# Altium schematic sheet Sheet2.SchDoc
size A3
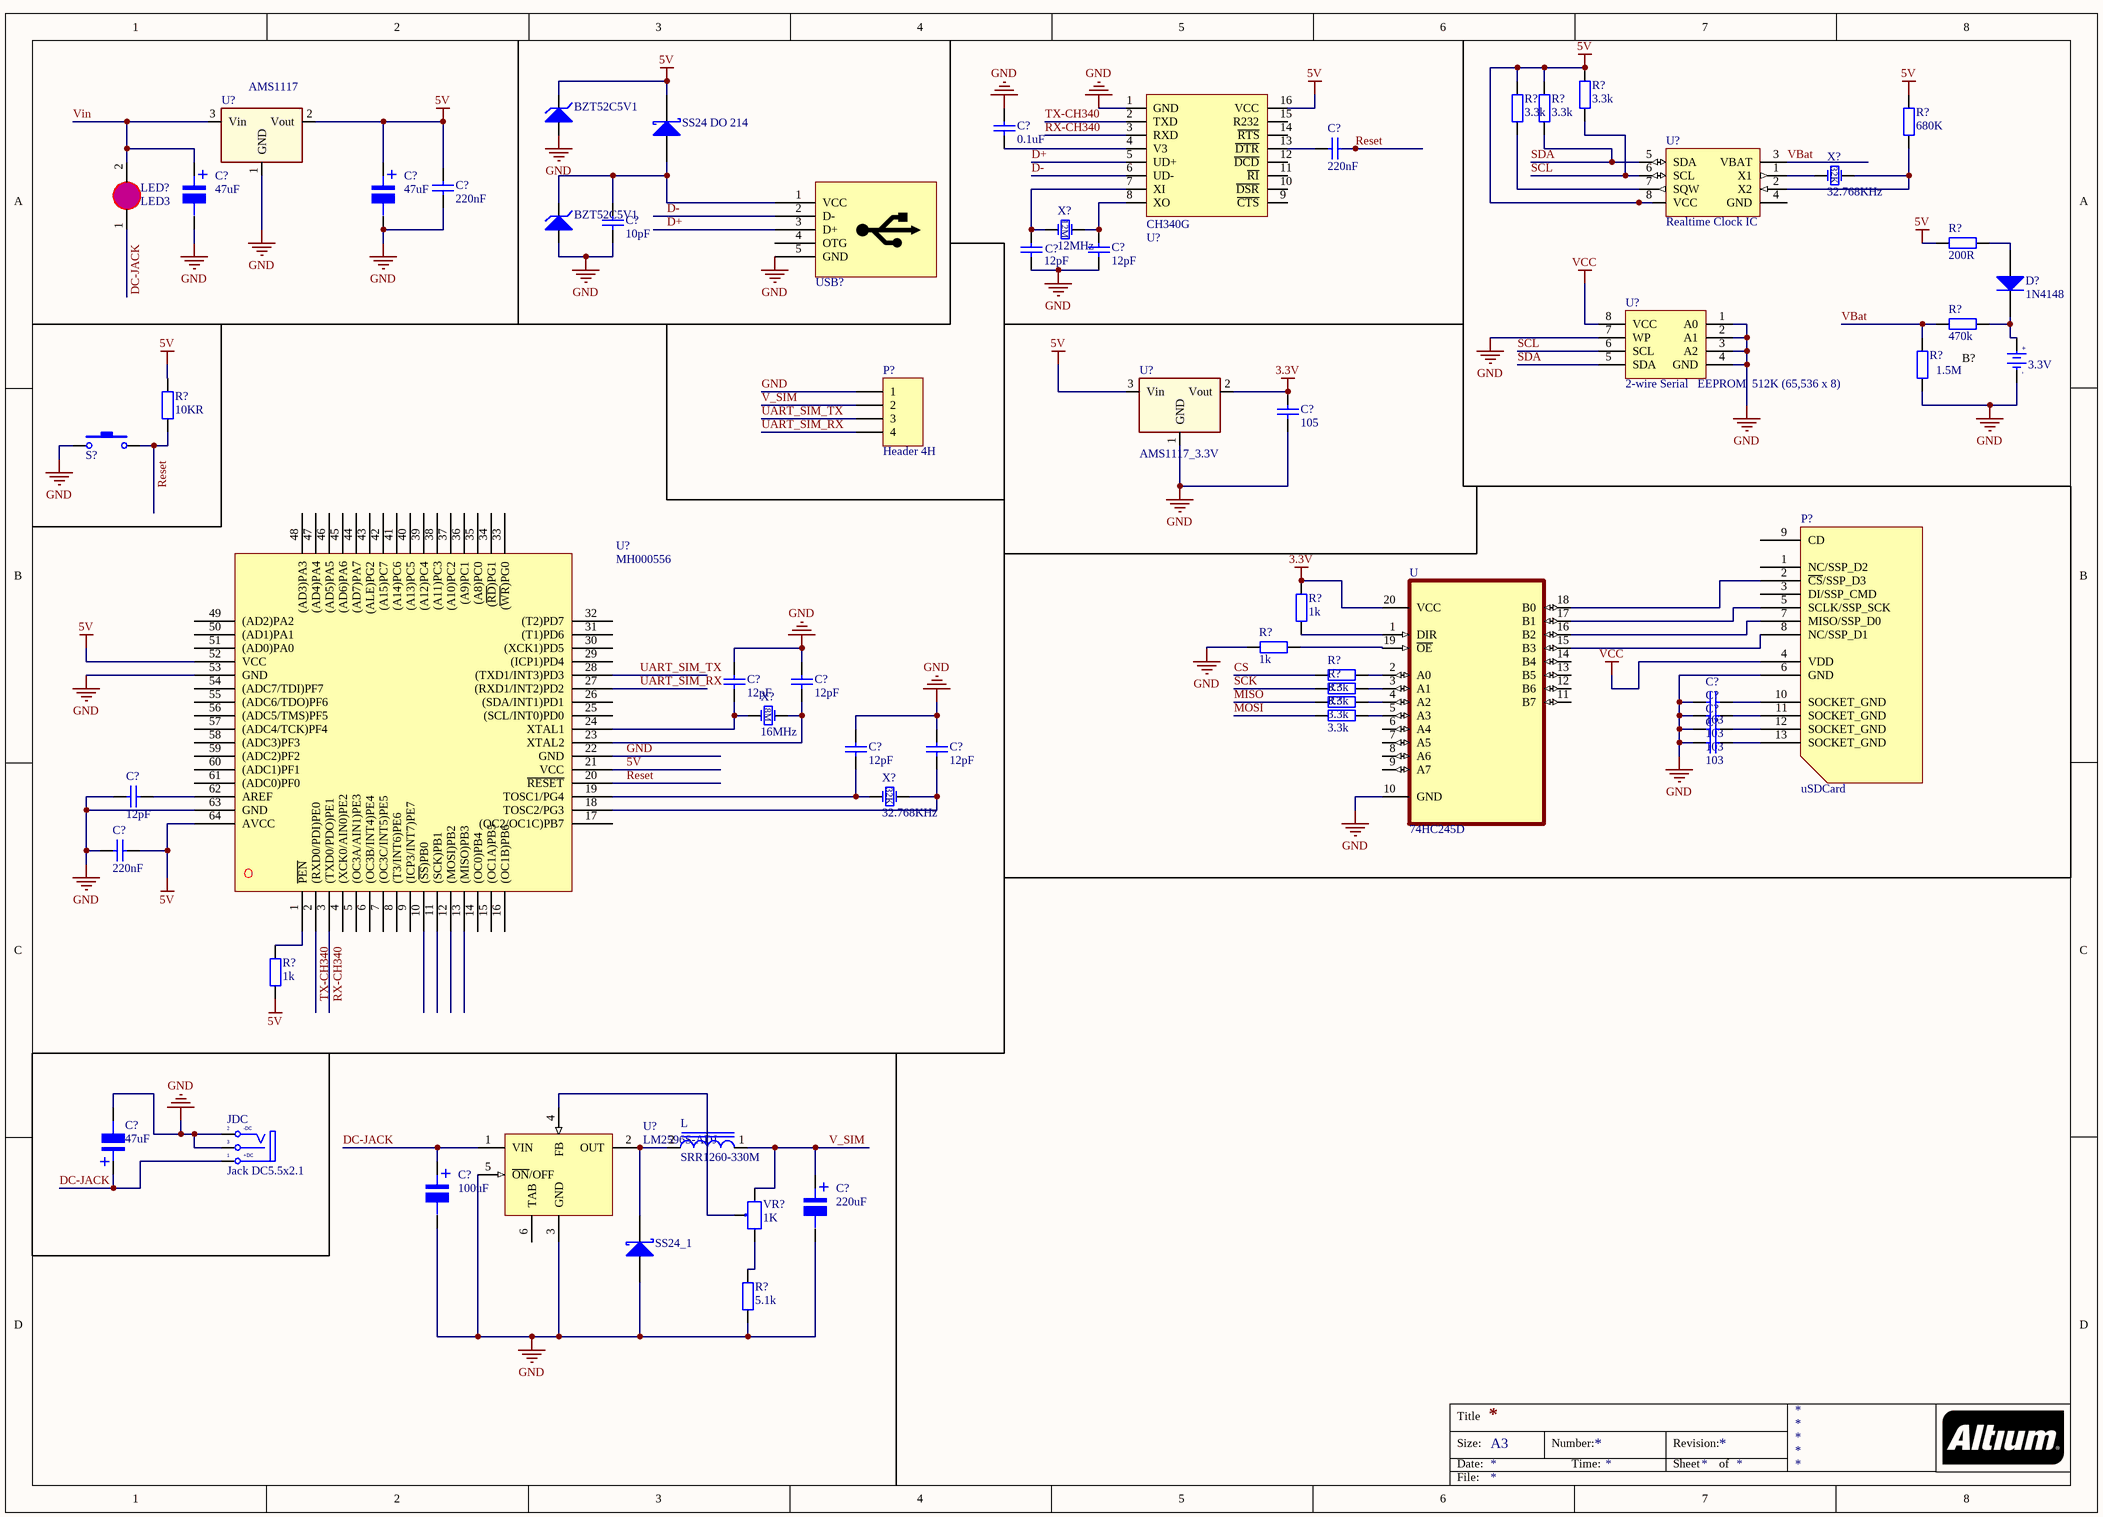
[diagram p0: Sheet2.SchDoc]

## Parts
(Parts that share a designator on the sheet are numbered #1, #2 ... from top to bottom, then left to right.)
B?  value 3.3V  [CR1220]  (hidden comment: BATT-Holder)
BZT52C5V1#1  5.6V/500mW  [DIODE_SOD-123]  (value not drawn)
BZT52C5V1#2  5.6V/500mW  [DIODE_SOD-123]  (value not drawn)
C?#1  0.1uF  [Tu 0805]
C?#2  220nF  [tu 0805]
C?#3  47uF  [tu nhom 6.3 (d)]
C?#4  47uF  [tu nhom 6.3 (d)]
C?#5  220nF  [tu 0805]
C?#6  10pF  [tu 0805]
C?#7  12pF  [Tu 0805]
C?#8  12pF  [Tu 0805]
C?#9  105  [Tu 0805]
C?#10  12pF  [Tu 0805]
C?#11  12pF  [Tu 0805]
C?#12  103  [Tu 0805]
C?#13  103  [Tu 0805]
C?#14  103  [Tu 0805]
C?#15  103  [Tu 0805]
C?#16  12pF  [Tu 0805]
C?#17  12pF  [Tu 0805]
C?#18  12pF  [Tu 0805]
C?#19  220nF  [tu 0805]
C?#20  47uF  [tu nhom 6.3 (d)]
C?#21  100uF  [tu nhom 8 (f)]
C?#22  220uF  [tu nhom 8 (f)]
D?  1N4148  [SOD-123]
JDC  Jack DC5.5x2.1  [DC-IN]
L  SRR1260-330M  [INDP125125X600N]
LED?  LED3  [LED0805]
P?#1  Header 4H  [HDR1X4H]
P?#2  uSDCard  [MEM2055-00-190-01-A]
R?#1  3.3k  [tro smd 0805]
R?#2  3.3k  [tro smd 0805]
R?#3  3.3k  [tro smd 0805]
R?#4  680K  [tro smd 0805]
R?#5  200R  [tro smd 0805]
R?#6  470k  [Tro SMD 0805]
R?#7  1.5M  [Tro SMD 0805]
R?#8  10KR  [tro smd 0805]
R?#9  1k  [tro smd 0805]
R?#10  1k  [tro smd 0805]
R?#11  3.3k  [tro smd 0805]
R?#12  3.3k  [tro smd 0805]
R?#13  3.3k  [tro smd 0805]
R?#14  3.3k  [tro smd 0805]
R?#15  1k  [tro smd 0805]
R?#16  5.1k  [tro smd 0805]
S?  MH001036  [SW-SMD]  (value not drawn)
SS24_1  60V/1A  [DIODE_DO214AC_SMA]  (value not drawn)
SS24_DO_214  60V/1A  [DIODE_DO214AC_SMA]  (value not drawn)
U  74HC245D  [SOIC127P1032X265-20N]
U?#1  CH340G  [SO-16]  (value not drawn)
U?#2  AMS1117  [SOT223]
U?#3  Realtime Clock IC  [SOIC8]
U?#4  2-wire Serial   EEPROM  512K (65,536 x 8)  [SOIC8]
U?#5  AMS1117_3.3V  [SOT223]
U?#6  MH000556  [MEGA128L]
U?#7  LM2596S-ADJ  [TO263-5]
USB?  MiniUSB 5P SMD  [USB-B-Mini]  (value not drawn)
VR?  1K  [RVAR10K]
X?#1  32.768KHz  [Crystal_ABS07_SMD-3.2x1.5MM]
X?#2  12MHz  [CRYSTAL_ABM3 5x3.2mm]
X?#3  16MHz  [CRYSTAL_ABM3 5x3.2mm]
X?#4  32.768KHz  [Crystal_ABS07_SMD-3.2x1.5MM]

## Nets
3.3V: C?#9.2 R?#9.1 U.20(VCC) U?#5.2(Vout)
5V: BZT52C5V1#1.2(K) C?#4.1 C?#5.1 C?#19.1 R?#1.2 R?#2.2 R?#3.2 R?#4.2 R?#5.1 R?#8.2 R?#15.1 SS24_DO_214.2(K) U?#1.16(VCC) U?#2.2(Vout) U?#3.8(VCC) U?#5.3(Vin) U?#6.21(VCC) U?#6.52(VCC) U?#6.64(AVCC)
GND: B?.2(-) BZT52C5V1#1.1(A) BZT52C5V1#2.1(A) C?#1.1 C?#3.2 C?#4.2 C?#5.2 C?#6.2 C?#7.2 C?#8.2 C?#9.1 C?#10.1 C?#11.1 C?#12.2 C?#13.2 C?#14.2 C?#15.2 C?#16.1 C?#17.1 C?#18.1 C?#19.2 C?#20.2 C?#21.2 C?#22.2 JDC.2(TN) JDC.3(S) P?#1.1 P?#2.6(GND) R?#7.1 R?#10.2 R?#16.1 S?.1 SS24_1.1(A) U.10(GND) U?#1.1(GND) U?#2.1(GND) U?#4.1(A0) U?#4.2(A1) U?#4.3(A2) U?#4.4(GND) U?#4.7(WP) U?#5.1(GND) U?#6.22(GND) U?#6.53(GND) U?#6.63(GND) U?#7.3(GND) U?#7.5(~{ON}/OFF) USB?.5(GND)
VCC: P?#2.4(VDD) U?#4.8(VCC)
CS: R?#11.1
D+: U?#1.5(UD+) USB?.3(D+)
D-: U?#1.6(UD-) USB?.2(D-)
DC-JACK: C?#20.1 C?#21.1 JDC.1(T) LED?.1(A) U?#7.1(VIN)
MISO: R?#13.1
MOSI: R?#14.1
Reset: C?#2.1 R?#8.1 S?.2 U?#6.20(~{RESET})
RX-CH340: U?#1.3(RXD) U?#6.3((TXD0/PDO)PE1)
SCK: R?#12.1
SCL: R?#1.1 U?#3.6(SCL) U?#4.6(SCL)
SDA: R?#3.1 U?#3.5(SDA) U?#4.5(SDA)
TX-CH340: U?#1.2(TXD) U?#6.2((RXD0/PDI)PE0)
UART_SIM_RX: P?#1.4 U?#6.27((RXD1/INT2)PD2)
UART_SIM_TX: P?#1.3 U?#6.28((TXD1/INT3)PD3)
V_SIM: C?#22.1 L.1 P?#1.2 VR?.3
VBat: R?#6.2 R?#7.2 U?#3.3(VBAT)
Vin: C?#3.1 LED?.2(K) U?#2.3(Vin)
NetB?_1: B?.1(+) D?.2(K) R?#6.1
NetBZT52C5V1#2_2: BZT52C5V1#2.2(K) C?#6.1 SS24_DO_214.1(A) USB?.1(VCC)
NetC?#1_2: C?#1.2 U?#1.4(V3)
NetC?#2_2: C?#2.2 U?#1.13(~{DTR})
NetC?#7_1: C?#7.1 U?#1.7(XI) X?#2.2(OSC2)
NetC?#8_1: C?#8.1 U?#1.8(XO) X?#2.1(OSC1)
NetC?#10_2: C?#10.2 U?#6.24(XTAL1) X?#3.2(OSC2)
NetC?#11_2: C?#11.2 U?#6.23(XTAL2) X?#3.1(OSC1)
NetC?#12_1: C?#12.1 P?#2.10(SOCKET_GND)
NetC?#13_1: C?#13.1 P?#2.11(SOCKET_GND)
NetC?#14_1: C?#14.1 P?#2.12(SOCKET_GND)
NetC?#15_1: C?#15.1 P?#2.13(SOCKET_GND)
NetC?#16_2: C?#16.2 U?#6.19(TOSC1/PG4) X?#4.2(OSC2)
NetC?#17_2: C?#17.2 U?#6.18(TOSC2/PG3) X?#4.1(OSC1)
NetC?#18_2: C?#18.2 U?#6.62(AREF)
NetD?_1: D?.1(A) R?#5.2
NetL_2: L.2 SS24_1.2(K) U?#7.2(OUT)
NetP?#2_2: P?#2.2(~{CS}/SSP_D3) U.18(B0)
NetP?#2_5: P?#2.5(SCLK/SSP_SCK) U.17(B1)
NetP?#2_7: P?#2.7(MISO/SSP_D0) U.16(B2)
NetP?#2_8: P?#2.8(NC/SSP_D1) U.15(B3)
NetR?#2_1: R?#2.1 U?#3.7(SQW)
NetR?#4_1: R?#4.1 U?#3.2(X2) X?#1.1(OSC1)
NetR?#9_2: R?#9.2 U.1(DIR)
NetR?#10_1: R?#10.1 U.19(~{OE})
NetR?#11_2: R?#11.2 U.2(A0)
NetR?#12_2: R?#12.2 U.3(A1)
NetR?#13_2: R?#13.2 U.4(A2)
NetR?#14_2: R?#14.2 U.5(A3)
NetR?#15_2: R?#15.2 U?#6.1(~{PEN})
NetR?#16_2: R?#16.2 VR?.1
NetU?#3_1: U?#3.1(X1) X?#1.2(OSC2)
NetU?#7_4: U?#7.4(FB) VR?.2

Not connected (* = marked no-connect by the designer): P?#2 1(NC/SSP_D2) 3(DI/SSP_CMD) 9(CD); U 6(A4) 7(A5) 8(A6) 9(A7) 11(B7) 12(B6) 13(B5) 14(B4); U?#1 9(~{CTS}) 10(~{DSR}) 11(~{RI}) 12(~{DCD}) 14(~{RTS}) 15(R232); U?#3 4(GND); U?#6 4((XCK0/AIN0)PE2) 5((OC3A/AIN1)PE3) 6((OC3B/INT4)PE4) 7((OC3C/INT5)PE5) 8((T3/INT6)PE6) 9((ICP3/INT7)PE7) 10((~{SS})PB0) 11((SCK)PB1) 12((MOSI)PB2) 13((MISO)PB3) 14((OC0)PB4) 15((OC1A)PB5) 16((OC1B)PB6) 17((OC2/OC1C)PB7) 25((SCL/INT0)PD0) 26((SDA/INT1)PD1) 29((ICP1)PD4) 30((XCK1)PD5) 31((T1)PD6) 32((T2)PD7) 33((~{WR})PG0) 34((~{RD})PG1) 35((A8)PC0) 36((A9)PC1) 37((A10)PC2) 38((A11)PC3) 39((A12)PC4) 40((A13)PC5) 41((A14)PC6) 42((A15)PC7) 43((ALE)PG2) 44((AD7)PA7) 45((AD6)PA6) 46((AD5)PA5) 47((AD4)PA4) 48((AD3)PA3) 49((AD2)PA2) 50((AD1)PA1) 51((AD0)PA0) 54((ADC7/TDI)PF7) 55((ADC6/TDO)PF6) 56((ADC5/TMS)PF5) 57((ADC4/TCK)PF4) 58((ADC3)PF3) 59((ADC2)PF2) 60((ADC1)PF1) 61((ADC0)PF0); U?#7 6(TAB); USB? 4(OTG)

## Notes on the sheet
- Title
- Size:
- Date:
- A3
- Number:
- Time:
- Revision:
- Sheet
- of
- File:
- (in symbol ABM3-8.000MHZ-D2Y-T) 8M
- (in symbol ABM3-12.000MHZ-D2Y-T) 12M
- (in symbol ABS07-32.768KHZ-T) 32K
- (in symbol Jac_DC) -DC; +DC
- (in symbol Tu Nhom 47uF 25V) +
- (in symbol Tu Nhom 47uF 50V) +
- (in symbol Tu Nhom 100uF 50V) +
- (in symbol Tu Nhom 220uF 25V) +

## Library data of the parts
B? = BATT-Holder: Battery holder; Designed By: John MacTavish; Vendor: Digikey; ComponentLink1Description: Digikey Part Link; ComponentLink2Description: Open Datasheet
BZT52C5V1#1 BZT52C5V1#2 = NZH5V6B,115: BZT52C5V1; Solder: SMT; Value: 5.6V/500mW; MPN: NZH5V6B,115
C?#1 C?#7 C?#8 C?#10 C?#11 C?#16-C?#18 = Tu 102: Dán; Ten_Linh_Kien: Tụ 0805 102-1nF 10% 50V; Ma_Hang: MH004549; Don_Vi: Con; Kieu_Chan: *; Ghi_Chu: *; Chung_Loai: Dán
C?#2 C?#5 C?#19 = Tu 0805 220nF 50V 10%: Dán; Don_Vi: Con; So_Chan: 2; Ten_Linh_Kien: Tụ 0805 220nF 50V 10%; Ma_Hang: MH008099; Chung_Loai: Dán; Kieu_Chan: *
C?#3 C?#4 = Tu Nhom 47uF 25V: Dán; Don_Vi: Con; So_Chan: 2; Ten_Linh_Kien: Tụ Nhôm 47uF 25V 6.3x5.5MM; Ma_Hang: MH002216; Chung_Loai: Dán; Kieu_Chan: *
C?#6 = Tu 0805 10pF 50V 10%: Dán; Don_Vi: Con; So_Chan: 2; Ten_Linh_Kien: Tụ 0805 10P 10% 50V; Ma_Hang: MH004554; Chung_Loai: Dán; Kieu_Chan: *
C?#9 = Tu 105: Dán; Ten_Linh_Kien: Tụ 0805 105-1uF 10% 50V; Don_Vi: Con; Ma_Hang: MH004552; Kieu_Chan: *; Chung_Loai: Dán; Ghi_Chu: *
C?#12-C?#15 = Tu 103: Dán; Ten_Linh_Kien: Tụ 0805 103-10nF 10% 50V; Ma_Hang: MH004550; Don_Vi: Con; Chung_Loai: Dán; Kieu_Chan: *; Ghi_Chu: *
C?#20 = Tu Nhom 47uF 50V: Dán; Don_Vi: Con; So_Chan: 2; Ten_Linh_Kien: Tụ Nhôm 47uF 50V 6.3x5.5MM; Ma_Hang: MH002217; Chung_Loai: Dán; Kieu_Chan: *
C?#21 = Tu Nhom 100uF 50V: Dán; Don_Vi: Con; So_Chan: 2; Ten_Linh_Kien: Tụ Nhôm 100uF 50V 8x10.2MM; Ma_Hang: MH002223; Chung_Loai: Dán; Kieu_Chan: *
C?#22 = Tu Nhom 220uF 25V: Dán; Don_Vi: Con; So_Chan: 2; Ten_Linh_Kien: Tụ Nhôm 220uF 25V; Ma_Hang: MH002221; Chung_Loai: Dán; Kieu_Chan: *
D? = 1N4148-W-7: DIODE GEN PURP 100V 300MA SOD123; MPN: 1N4148W-7-F; MFR: Diodes Incorporated; Solder: SMT; Value: 100V/300MA
JDC = Jac_DC: Cắm; Ten_Linh_Kien: Jack DC5.5x2.1MM DC5501; Ma_Hang: MH000923; Don_Vi: Con; Kieu_Chan: *; Ghi_Chu: *; Chung_Loai: Cắm
L = SRR1260-330M: 33ÂµH Shielded Wirewound Inductor 3A 60mOhm Max Nonstandard; MF: Bourns; Price: None; Package: Nonstandard Bourns; MP: SRR1260-330M; Value: *; SnapEDA_Link: https://www.snapeda.com/parts/SRR1260-330M/Bourns/view-part/378985/?ref=snap; Availability: Unavailable
LED? = LEDSMD: LED 3mm
P?#1 = Header 4H: Header, 4-Pin, Right Angle; LatestRevisionDate: 17-Jul-2002; LatestRevisionNote: Re-released for DXP Platform.; Publisher: Altium Limited
P?#2 = SDMMC: Micro SD Card Holder; MFR: GCT; MPN: MEM2055-00-190-01-A
R?#1-R?#3 R?#11-R?#14 = Tro 0805 1% 3.3k: Dán; Don_Vi: Con; So_Chan: 2; Ten_Linh_Kien: Trở 0805 1% 3.3k; Ma_Hang: MH005472; Chung_Loai: Dán; Kieu_Chan: *
R?#4 = Tro 0805 1% 680R: Dán; Don_Vi: Con; So_Chan: 2; Ten_Linh_Kien: Trở 0805 1% 680R; Ma_Hang: MH005487; Chung_Loai: Dán; Kieu_Chan: *
R?#5 = Tro 0805 5% 200R: Dán; Don_Vi: Con; So_Chan: 2; Ten_Linh_Kien: Trở 0805 5% 200R; Ma_Hang: MH005257; Chung_Loai: Dán; Kieu_Chan: *
R?#6 = Tro 0805 5% 470k: Dán; Don_Vi: Con; Ma_Hang: MH005340; So_Chan: 2; Ten_Linh_Kien: Trở 0805 5% 470k; Chung_Loai: Dán; Kieu_Chan: *
R?#7 = Tro 0805 5% 820k: Dán; Don_Vi: Con; Ma_Hang: MH005345; So_Chan: 2; Ten_Linh_Kien: Trở 0805 5% 820k; Chung_Loai: Dán; Kieu_Chan: *
R?#8 = Tro 0805 1% 0.22R: Dán; Don_Vi: Con; So_Chan: 2; Ten_Linh_Kien: Trở 0805 1% 0.22R; Ma_Hang: MH005466; Chung_Loai: Dán; Kieu_Chan: *
R?#9 R?#10 R?#15 = Tro 0805 1% 1k: Dán; Don_Vi: Con; So_Chan: 2; Ten_Linh_Kien: Trở 0805 1% 1k; Ma_Hang: MH005468; Chung_Loai: Dán; Kieu_Chan: *
R?#16 = Tro 0805 1% 5.1k: Dán; Don_Vi: Con; So_Chan: 2; Ten_Linh_Kien: Trở 0805 1% 5.1k; Ma_Hang: MH008812; Chung_Loai: Dán; Kieu_Chan: *
S? = SW-SMD: Dán; Value: Nút Nhấn 2 Chân 3x6x2.5MM SMD
SS24_1 SS24_DO_214 = B160-13-F: DIODE SCHOTTKY 60V 1A SMA DO-214A; CompanyID: VT-00897; Solder: SMT; MPN: B160-13-F; Value: 60V/1A; MFR: *
U = 74HC245D: Transceiver, Non-Inverting 1 Element 8 Bit per Element 3-State Output 20-SOIC; MF: Toshiba; Value: *; SnapEDA_Link: https://www.snapeda.com/parts/74HC245D/Toshiba%20Semiconductor%20and%20Storage/view-part/1775236/?ref=snap; Package: SOIC-20 Toshiba; MP: 74HC245D; Price: None; Availability: Unavailable
U?#2 U?#5 = AMS1117: Regulator SMD Chip; Designed By: John MacTavish; Vendor: Digikey; ComponentLink1Description: Digikey Part Link; ComponentLink2Description: Open Datasheet; ComponentLink2URL: H:\LIBRARY\LIBRARY.Datasheet\
U?#3 = DS1307: Manufacturer: Maxim; ComponentLink1Description: Digikey Part Link; ComponentLink2Description: Open Datasheet; ComponentLink2URL: H:\LIBRARY\LIBRARY.Datasheet\DS1307.pdf
U?#4 = EEPROM.24Cxxx: Manufacturer: Atmel; Value: 512Kb; ComponentLink2Description: Open datasheet; ComponentLink2URL: H:\LIBRARY\LIBRARY.Datasheet\24c512.pdf
U?#6 = Atmega128: Dán; Value: ATMEGA128A-AU TQFP64
U?#7 = LM2596S-ADJ: SIMPLE SWITCHER Power Converter 150 KHz 3A Step-Down Voltage Regulator; MPN: LM2596SX-ADJ/NOPB; Solder: SMT; Value: LM2596S-ADJ; Category: IC
USB? = USB_MINI: Dán; Ma_Hang: MH001022; Don_Vi: Con; Ten_Linh_Kien: MiniUSB 5P SMD; Kieu_Chan: *; Chung_Loai: Dán; Ghi_Chu: *
VR? = Bien Tro Tinh Chinh 1K: Cắm; Don_Vi: Con; Ten_Linh_Kien: Biến Trở VR 102-1K 3296W; Ma_Hang: MH003234; Kieu_Chan: *; Chung_Loai: Cắm
X?#1 X?#4 = ABS07-32.768KHZ-T: CRYSTAL 32.7680KHZ 12.5pF SMD; Solder: SMT; CompanyID: VT-01153; MPN: ABS07-32.768KHZ-T; Value: 32.768KHz; Category: CRYSTAL
X?#2 = ABM3-12.000MHZ-D2Y-T: CRYSTAL 12.0000MHZ 18pF SMD; Solder: SMT; CompanyID: VT-01247; MPN: ABM3-12.000MHZ-D2Y-T; Value: 12MHz; Category: CRYSTAL
X?#3 = ABM3-8.000MHZ-D2Y-T: CRYSTAL 8.0000MHZ 18pF SMD; Value: 8MHz; Solder: SMT; CompanyID: VT-00517; MPN: ABM3-8.000MHZ-D2Y-T; Category: CRYSTAL